# Altium schematic sheet MCU.SchDoc: MCU
size A4; Author: Álvaro Hernando; CompanyName: bq - Mundo Reader; Organization: bq - Mundo Reader; DocumentNumber: 1; Revision: 1.0; SheetNumber: 1; SheetTotal: 3; ProjectName: ZOWI_Ultrasonic
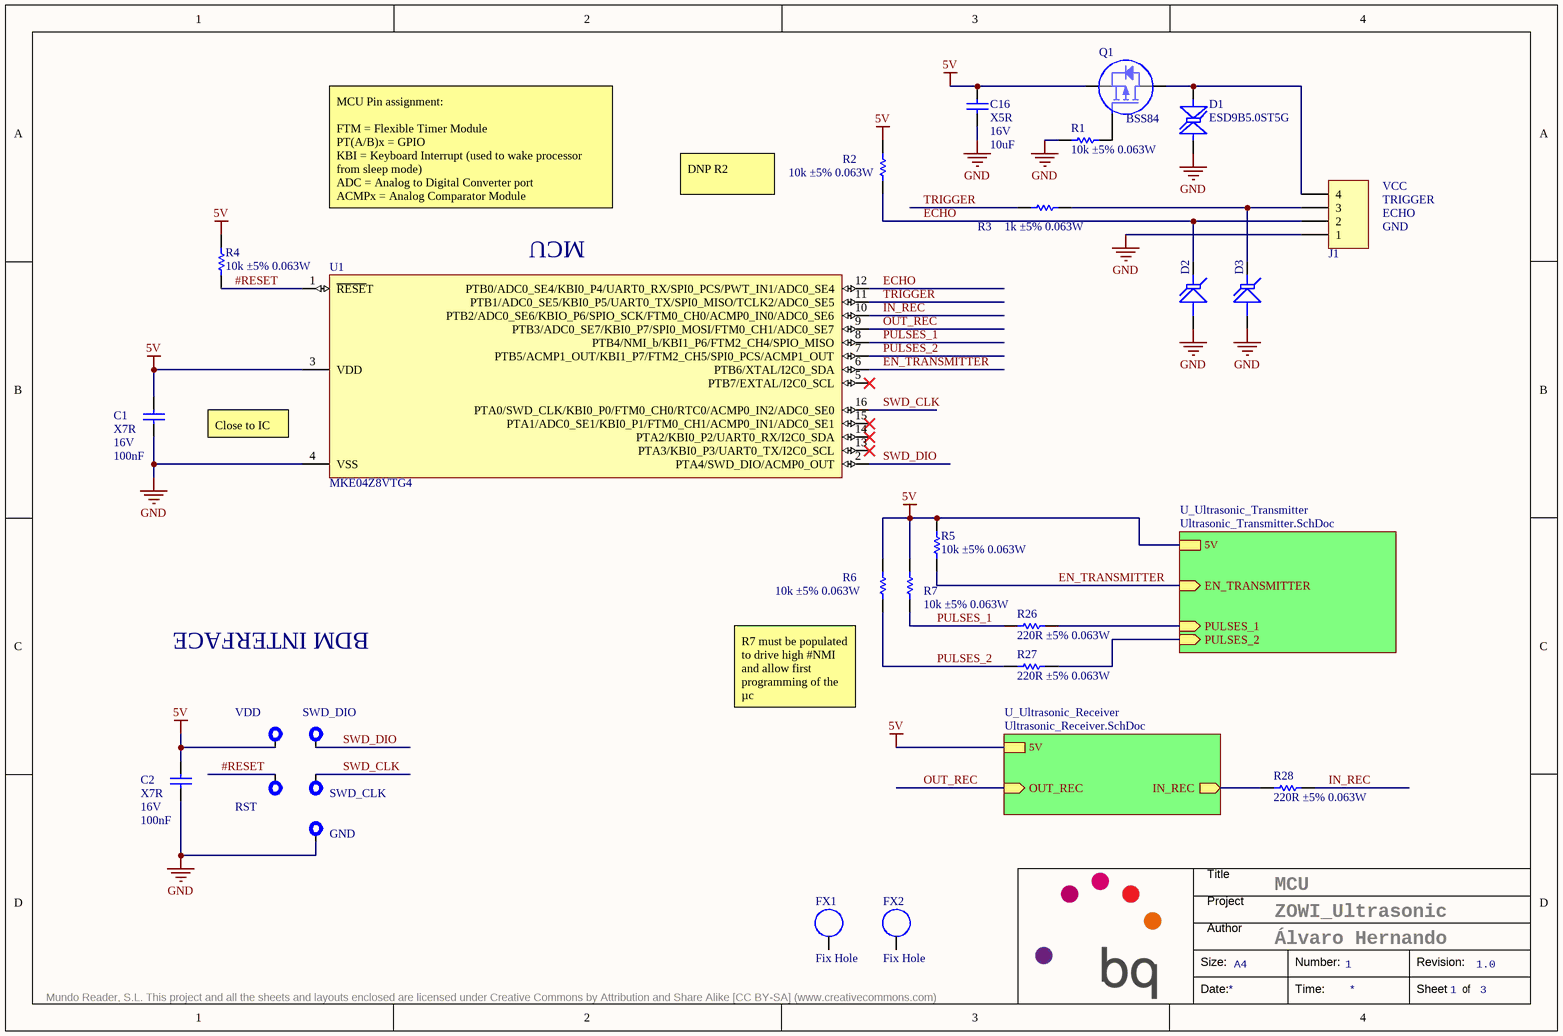
[diagram p0: MCU.SchDoc]

## Parts
C1  Dielectric: X7R  Voltage: 16V  Capacitance: 100nF  [C0402]  (hidden comment: Capacitor)
C2  Dielectric: X7R  Voltage: 16V  Capacitance: 100nF  [C0402]  (hidden comment: Capacitor)
C16  Dielectric: X5R  Voltage: 16V  Capacitance: 10uF  [C0603]  (hidden comment: Capacitor)
D1  ESD9B5.0ST5G  [SOD923]
D2  ESD9L5.0ST5G  [SOD923]  (value not drawn)
D3  ESD9L5.0ST5G  [SOD923]  (value not drawn)
FX1  Fix Hole  [Fix_Hole_3.2mm]  (no BOM)
FX2  Fix Hole  [Fix_Hole_3.2mm]  (no BOM)
GND  Testpoint  [TP_POWER]  (value not drawn)  (no BOM)
J1  1x4 MTE Angled Header 2.54mm  [1x4 MTE Angled Header 2.54mm]  (value not drawn)
Q1  BSS84  [SOT23-3]
R1  value 10k ±5% 0.063W  [R0402]  (hidden comment: Resistor)
R2  value 10k ±5% 0.063W  [R0402]  (hidden comment: Resistor)
R3  value 1k ±5% 0.063W  [R0402]  (hidden comment: Resistor)
R4  value 10k ±5% 0.063W  [R0402]  (hidden comment: Resistor)
R5  value 10k ±5% 0.063W  [R0402]  (hidden comment: Resistor)
R6  value 10k ±5% 0.063W  [R0402]  (hidden comment: Resistor)
R7  value 10k ±5% 0.063W  [R0402]  (hidden comment: Resistor)
R26  value 220R ±5% 0.063W  [R0402]  (hidden comment: Resistor)
R27  value 220R ±5% 0.063W  [R0402]  (hidden comment: Resistor)
R28  value 220R ±5% 0.063W  [R0402]  (hidden comment: Resistor)
RST  Testpoint  [TP_POWER]  (value not drawn)  (no BOM)
SWD_CLK  Testpoint  [TP_POWER]  (value not drawn)  (no BOM)
SWD_DIO  Testpoint  [TP_POWER]  (value not drawn)  (no BOM)
U1  MKE04Z8VTG4  [TSSOP16]
VDD  Testpoint  [TP_POWER]  (value not drawn)  (no BOM)

## Sub-sheets
U_Ultrasonic_Receiver = Ultrasonic_Receiver.SchDoc: IN_REC (out), OUT_REC (in), 5V
U_Ultrasonic_Transmitter = Ultrasonic_Transmitter.SchDoc: EN_TRANSMITTER (in), PULSES_1 (in), PULSES_2 (in), 5V

## Nets
5V: C1.2 C2.2 C16.2 Q1.2(S) R2.2 R4.2 R5.2 R6.2 R7.2 U1.3(VDD) VDD.1 ; sheet U_Ultrasonic_Transmitter/5V, sheet U_Ultrasonic_Receiver/5V
GND: C1.1 C2.1 C16.1 D1.A D2.A D3.A GND.1 J1.1 R1.2 U1.4(VSS)
#RESET: R4.1 RST.1 U1.1(~{RESE}T)
ECHO: D2.K J1.2 R2.1 U1.12(PTB0/ADC0_SE4/KBI0_P4/UART0_RX/SPI0_PCS/PWT_IN1/ADC0_SE4)
EN_TRANSMITTER: R5.1 U1.6(PTB6/XTAL/I2C0_SDA) ; sheet U_Ultrasonic_Transmitter/EN_TRANSMITTER
IN_REC: R28.2 U1.10(PTB2/ADC0_SE6/KBIO_P6/SPIO_SCK/FTM0_CH0/ACMP0_IN0/ADC0_SE6)
OUT_REC: U1.9(PTB3/ADC0_SE7/KBI0_P7/SPI0_MOSI/FTM0_CH1/ADC0_SE7) ; sheet U_Ultrasonic_Receiver/OUT_REC
PULSES_1: R7.1 R26.1 U1.8(PTB4/NMI_b/KBI1_P6/FTM2_CH4/SPIO_MISO)
PULSES_2: R6.1 R27.1 U1.7(PTB5/ACMP1_OUT/KBI1_P7/FTM2_CH5/SPI0_PCS/ACMP1_OUT)
SWD_CLK: SWD_CLK.1 U1.16(PTA0/SWD_CLK/KBI0_P0/FTM0_CH0/RTC0/ACMP0_IN2/ADC0_SE0)
SWD_DIO: SWD_DIO.1 U1.2(PTA4/SWD_DIO/ACMP0_OUT)
TRIGGER: R3.1 U1.11(PTB1/ADC0_SE5/KBI0_P5/UART0_TX/SPI0_MISO/TCLK2/ADC0_SE5)
NetD1_K: D1.K J1.4 Q1.3(D)
NetD3_K: D3.K J1.3 R3.2
NetQ1_1: Q1.1(G) R1.1
NetR26_2: R26.2 ; sheet U_Ultrasonic_Transmitter/PULSES_1
NetR27_2: R27.2 ; sheet U_Ultrasonic_Transmitter/PULSES_2
NetR28_1: R28.1 ; sheet U_Ultrasonic_Receiver/IN_REC

Not connected (* = marked no-connect by the designer): FX1 1; FX2 1; U1 5(PTB7/EXTAL/I2C0_SCL)* 13(PTA3/KBI0_P3/UART0_TX/I2C0_SCL)* 14(PTA2/KBI0_P2/UART0_RX/I2C0_SDA)* 15(PTA1/ADC0_SE1/KBI0_P1/FTM0_CH1/ACMP0_IN1/ADC0_SE1)*

## Notes on the sheet
- MCU Pin assignment:
  FTM = Flexible Timer Module
  PT(A/B)x = GPIO
  KBI = Keyboard Interrupt (used to wake processor from sleep mode)
  ADC = Analog to Digital Converter port
  ACMPx = Analog Comparator Module
  SWD = Serial Wire Debug Interface
  RTC = Real-Time Clock
  PWT = Pulse Width Timer
- (near U1) MCU
- DNP R2
- VCC
- TRIGGER
- ECHO
- GND
- Close to IC
- BDM INTERFACE
- R7 must be populated to drive high #NMI
  and allow first programming of the µc
- Title
- Project
- Size:
- Author
- A4
- Number:
- Revision:
- Mundo Reader, S.L. This project and all the sheets and layouts enclosed are licensed under Creative Commons by Attribution and Share Alike [CC BY-SA] (www.creativecommons.com)
- Date:
- Time:
- Sheet
- of

## Library data of the parts
C1 C2 = C0402_100nF_16V_±10%: Capacitor SMD; Manufacturer: Kemet; Value: 100nF ±10% 16V; Tolerance: ±10%; OrderingCode: C0402C104K4RAC; Temp_ Max: 125; Temp_ Min: -55; Part Number: C0402_100nF_16V_±10%
C16 = C0603_10uF_16V_±20%: Capacitor SMD; Manufacturer: Taiyo Yuden; Value: 10uF ±20% 16V; Tolerance: ±20%; OrderingCode: EMK107BBJ106MA-T; Temp_ Max: 85; Temp_ Min: -55; OrderingCode 2: C1608X5R1C106M080AB; Part Number: C0603_10uF_16V_±20%; Manufacturer 2: TDK
D1 = TVS 5Vdc Bidir: Protection, Bidirectional Transient Suppression Diodes; Manufacturer: ON Semiconductor; Voltage: 5Vdc; Breakdown Voltage: 5,8Vdc; Overvoltage Current: 1A; Temp_ Max: 150; Temp_ Min: -55; Part Number: TVS 5Vdc Bidir; OrderingCode: ESD9B5.0ST5G
D2 D3 = TVS 5Vdc Low Cap: Protection, Transient Suppression Diode; Manufacturer: ON Semiconductor; Voltage: 5Vdc; Breakdown Voltage: 5,4Vdc; Overvoltage Current: 1A; Temp_ Max: 125; Temp_ Min: -55; Part Number: TVS 5Vdc Low Cap; OrderingCode: ESD9L5.0ST5G
FX1 FX2 = FX_3.2: Part Number: FX_3.2
GND RST SWD_CLK SWD_DIO VDD = TP_POWER: Manufacturer: Oxley; OrderingCode: SMOX/060/B1; SAP: 303552; Part Number: TP_POWER
J1 = CON_MTE_Angled_HDR_THT2.54_4: Connector, 1x4 MTE Angled Header 2.54mm; Manufacturer: TE Connectivity; OrderingCode: 5-103635-3; Temp_ Max: 105; Temp_ Min: -65; Value: 4; Pitch: 2.54mm; Part Number: CON_MTE_Angled_HDR_THT2.54_4
Q1 = BSS84: PFET; Manufacturer: Fairchild Semiconductor; Vds: 50V; Vgss: 20V; Id: 0,13A; Temp_ Max: 150; Temp_ Min: -55; Part Number: BSS84; OrderingCode: BSS84
R1 R2 R4-R7 = R0402_10k_0.063W_±5%: Resistor, SMD; Manufacturer: Vishay; Tolerance: ±5%; OrderingCode: CRCW040210K0JN; Power: 0.063W; Resistance: 10k; Temp_ Max: 155; Temp_ Min: -55; PackageDescription: SMD; Part Number: R0402_10k_0.063W_±5%
R3 = R0402_1k_0.063W_±5%: Resistor, SMD; Manufacturer: Vishay; Tolerance: ±5%; OrderingCode: CRCW04021K00JN; Power: 0.063W; Resistance: 1k; Temp_ Max: 155; Temp_ Min: -55; PackageDescription: SMD; Part Number: R0402_1k_0.063W_±5%
R26-R28 = R0402_220R_0.063W_±5%: Resistor, SMD; Manufacturer: Vishay; Tolerance: ±5%; OrderingCode: CRCW0402220RJN; Power: 0.063W; Resistance: 220R; Temp_ Max: 155; Temp_ Min: -55; PackageDescription: SMD; Part Number: R0402_220R_0.063W_±5%
U1 = MKE04Z8VTG4: Processor, 32-bit microcontroller; Manufacturer: Freescale; Temp_ Max: 105; Temp_ Min: -40; Part Number: MKE04Z8VTG4; OrderingCode: MKE04Z8VTG4